# Altium schematic sheet k26_baseboard_fan.SchDoc: k26 Baseboard Fan
size A4; DrawnBy: Ch. Vogt; Organization: PBL; DocumentNumber: 1; Revision: r5; SheetNumber: 9
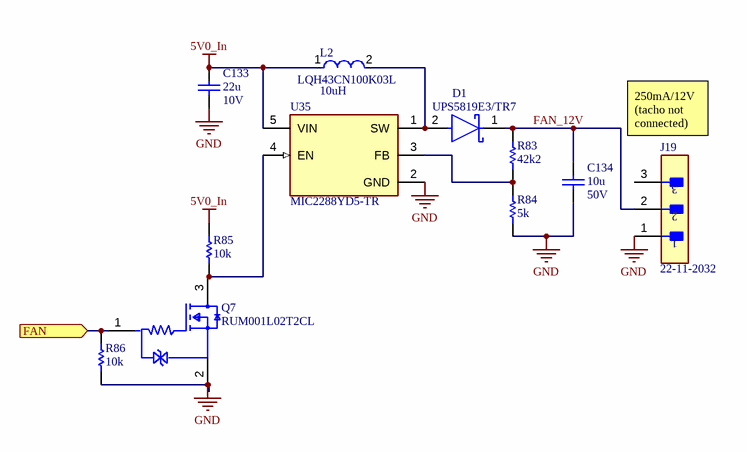
[diagram p0: k26_baseboard_fan.SchDoc]

## Parts
C133  22u  Rated DC Voltage (URdc): 10V  [CAPC1206]
C134  10u  Rated DC Voltage (URdc): 50V  [CAPC1206]
D1  UPS5819E3/TR7  [FP-457-04-MFG]
J19  22-11-2032  [FP-22-11-2032-MFG]
L2  LQH43CN100K03L  Inductance: 10uH  [FP-LQH43CN_03-MFG]
Q7  RUM001L02T2CL  [FP-VMT3-MFG]
R83  42k2  [RES0402]
R84  5k  [RES0402]
R85  10k  [RES0402]
R86  10k  [RES0402]
U35  MIC2288YD5-TR  [FP-TSOT-5LD-PL-1-MFG]

## Ports
FAN (in)

## Nets
5V0_In: C133.2 L2.1 R85.2 U35.5(VIN)
GND: C133.1 C134.1 J19.1 Q7.2(Source) R84.1 R86.1 U35.2(GND)
FAN: Q7.1(Gate) R86.2 ; port FAN
FAN_12V: C134.2 D1.1(C) J19.2 R83.2
NetD1_2: D1.2(A) L2.2 U35.1(SW)
NetQ7_3: Q7.3(Drain) R85.1 U35.4(EN)
NetR83_1: R83.1 R84.2 U35.3(FB)

Not connected (* = marked no-connect by the designer): J19 3

## Notes on the sheet
- 250mA/12V
  (tacho not connected)
- 1
- 2
- 3
- 4
- A
- B
- C
- Project:
- D
- Date:
- Drawing number:
- Rev:
- Format:
- A4 Q
- Drawn by:
- Laboratory:
- Page
- Sheet:
- of
- File:

## Library data of the parts
C133 = cap1206: Ceramic Capacitor, Multilayer, Ceramic, 10V, 10% +Tol, 10% -Tol, X7R, 15% TC, 22uF, Surface Mount, 1206; Manufacturer: Kyocera AVX; Manufacturer Part Number: 1206ZC226KAT2A; Multilayer: Yes; Supplier: Farnell; Supplier Part Number: 2094045; RoHS: Yes; Category: Ceramic Capacitors; Stock: 26392; Pricing: 5=0.49100, 50=0.42200, 250=0.37800, 500=0.33400, 1000=0.26300, 2500=0.23300, 12500=0.22800, 25000=0.22400 (CHF); Mounting Technology: Surface Mount; Pins: 2; Dielectric Material: Ceramic; Case/Package: 1206; Package Shape: Rectangular; Terminal Finish: Nickel; Min Operating Temperature: -55°C; Max Operating Temperature: 125°C; Value: 22uF; Capacitor Type: Ceramic; Tolerance  (fill in as +-): 10%; Packaging: Tape and Reel; Tolerance (fill in as +-): 10%; Termination: Wraparound; Temperature Characteristics Code: X7R; Package Style: SMTMeter; JESD-609 Code: e3; Length: 3.2mm; Width: 1.6mm; Height: 1.8mm; Reach SVHC Compliant: Yes; RoHS Compliant: Yes; ComponentLink1URL: https://datasheet.ciiva.com:443/pdfs/VipMasterIC/IC/AVXC/AVXC-S-A0009640452/AVXC-S-A0009640452-1.pdf?src-supplier=IHS+Markit; ComponentLink1Description: https://datasheet.ciiva.com:443/pdfs/VipMasterIC/IC/AVXC/AVXC-S-A0009640452/AVXC-S-A0009640452-1.pdf?src-supplier=IHS+Markit; ComponentLink2URL: https://datasheet.ciiva.com/25613/0900766b810a29b7-25613146.pdf?src-supplier=Rs; ComponentLink2Description: https://datasheet.ciiva.com/25613/0900766b810a29b7-25613146.pdf?src-supplier=Rs; ComponentLink3URL: https://datasheet.ciiva.com/7833/cx7r-7833598.pdf?src-supplier=Element14; ComponentLink3Description: https://datasheet.ciiva.com/7833/cx7r-7833598.pdf?src-supplier=Element14; ComponentLink4URL: https://datasheet.ciiva.com/5430/cx7r-218113-5430349.pdf?src-supplier=Mouser; ComponentLink4Description: https://datasheet.ciiva.com/5430/cx7r-218113-5430349.pdf?src-supplier=Mouser
C134 = cap1206: Ceramic Capacitor, Multilayer, Ceramic, 50V, 10% +Tol, 10% -Tol, X5R, 15% TC, 10uF, Surface Mount, 1206; Manufacturer: Murata; Manufacturer Part Number: GRM31CR61H106KA12L; Multilayer: Yes; Supplier: Distrelec; Supplier Part Number: 16576840; RoHS: Yes; Category: Ceramic Capacitors; Stock: 15417; Pricing: 3=0.63200, 100=0.56000, 250=0.50000, 500=0.44000, 2500=0.38000 (CHF); Mounting Technology: Surface Mount; Pins: 2; Dielectric Material: Ceramic; Case/Package: 1206; Package Shape: Rectangular; Terminal Finish: Nickel; Min Operating Temperature: -55°C; Max Operating Temperature: 85°C; Value: 10uF; Capacitor Type: Ceramic; Tolerance  (fill in as +-): 10%; Packaging: Tape and Reel; Tolerance (fill in as +-): 10%; Temperature Characteristics Code: X5R; JESD-609 Code: e3; Termination: Wraparound; Package Style: SMTMeter; Length: 3.2mm; Width: 1.6mm; Height: 1.6mm; Reach SVHC Compliant: Yes; RoHS Compliant: Yes; ComponentLink1URL: https://datasheet.ciiva.com:443/pdfs/VipMasterIC/IC/MURE/MURE-S-A0004373697/MURE-S-A0004376961-1.pdf?src-supplier=IHS+Markit; ComponentLink1Description: https://datasheet.ciiva.com:443/pdfs/VipMasterIC/IC/MURE/MURE-S-A0004373697/MURE-S-A0004376961-1.pdf?src-supplier=IHS+Markit; ComponentLink2URL: https://datasheet.ciiva.com/7719/1747481-7719155.pdf?src-supplier=Element14; ComponentLink2Description: https://datasheet.ciiva.com/7719/1747481-7719155.pdf?src-supplier=Element14; ComponentLink3URL: https://datasheet.ciiva.com/5427/product-5427068.pdf?src-supplier=Mouser; ComponentLink3Description: https://datasheet.ciiva.com/5427/product-5427068.pdf?src-supplier=Mouser; ComponentLink4URL: https://datasheet.ciiva.com/6270/partnumbering-e-01-6270263.pdf?src-supplier=Digi-Key; ComponentLink4Description: https://datasheet.ciiva.com/6270/partnumbering-e-01-6270263.pdf?src-supplier=Digi-Key; ComponentLink5URL: https://datasheet.ciiva.com/6270/partnumbering-e-01-6270262.pdf?src-supplier=Digi-Key; ComponentLink5Description: https://datasheet.ciiva.com/6270/partnumbering-e-01-6270262.pdf?src-supplier=Digi-Key; ComponentLink6URL: https://datasheet.ciiva.com/6270/partnumbering-e-01-6270264.pdf?src-supplier=Digi-Key; ComponentLink6Description: https://datasheet.ciiva.com/6270/partnumbering-e-01-6270264.pdf?src-supplier=Digi-Key; ComponentLink7URL: https://datasheet.ciiva.com/16440/c02e-16440669.pdf?src-supplier=Future+Electronics; ComponentLink7Description: https://datasheet.ciiva.com/16440/c02e-16440669.pdf?src-supplier=Future+Electronics
D1 = CMP-1055-00293-2: DIODE SCHOTTKY 40V 1A POWERMITE; Manufacturer: ON Semiconductor; Manufacturer Part Number: MBRM140T3G; Peak Non-Repetitive Surge Current: 50A; Forward Voltage: 550mV; Element Configuration: Single; Peak Reverse Current: 500uA; Polarity: Standard; Output Current: 1A; Number of Pins: 2; Lead Free: Lead Free; Package Quantity: 1; Width: 2.18mm; Current Rating: 1A; Min Operating Temperature: -55°C; Halogen Free: Halogen Free; Voltage Rating (DC): 40V; Max Repetitive Reverse Voltage (Vrrm): 40V; Forward Current: 1A; Radiation Hardening: No; Length: 2.05mm; Max Surge Current: 50A; Max Reverse Leakage Current: 500uA; Case/Package: 457; Packaging: Tape and Reel; Max Operating Temperature: 125°C; REACH SVHC: No SVHC; Height: 1.15mm; Max Forward Surge Current (Ifsm): 50A; Contact Plating: Tin; Average Rectified Current: 1A; Max Reverse Voltage (DC): 40V
J19 = CMP-04776-000113-1: CONN HEADER VERT 3POS 2.54MM; Manufacturer: Molex; Number Of Contacts: 3; Voltage Rating: 500V; Conn Gender: Male; Current Rating: 4A; Conn Orientation: Vertical; Device Class L2: Headers and Wire Housings; Number Of Rows: 1; Temperature Range High: +80°C; RoHS: TRUE; ComponentLink2URL: https://www.molex.com/webdocs/datasheets/pdf/en-us/0022112032_PCB_HEADERS.pdf; Manufacturer Part Number: 22-11-2032; Device Class L3: unset; Automotive: No; Temperature: -40°C to +80°C; Temperature Range Low: -40°C; Lead Free: Yes; Pitch: 2.54mm; Footprint Url: https://www.molex.com/pdm_docs/sd/022112032_sd.pdf; Digikey Description: CONN HEADER VERT 3POS 2.54MM; Contact Material: Gold,Nickel; Octopart: https://octopart.com/22-11-2032-molex-10085; Height: 10.91mm; Mouser Description: KK® 254 Solid Header, Vertical, with Friction Lock, 3 Circuits, Gold (Au) Plating; Package: 22-11-2032; Device Class L1: Connectors; Mounting Type: Through Hole; ComponentLink2Description: Datasheet; Category: Conn
L2 = CMP-06042-000232-1: FIXED IND 10UH 650MA 240 MOHM; Manufacturer: Murata; Tolerance: 10%; Shielding: Unshielded; Frequency: 23MHz; DC Resistance (DCR): 240mR; Test Frequency: 1MHz; Core Material: Ferrite; Number of Pins: 2; Case Code (Imperial): 1812; Radiation Hardening: No; Termination: SMD/SMT; Max Operating Temperature: 85°C; Self Resonant Frequency: 23MHz; Max DC Current: 650mA; Width: 3.2mm; Resistor Type: Wirewound; Inductance Tolerance: 10%; Height - Seated (Max): 0.11inch; Current Rating: 650mA; Length: 4.5mm; Height: 2.6mm; Military Standard: Not; DC Current: 650mA; Case/Package: 1812; Mount: Surface Mount; Packaging: Tape and Reel; Weight: 0.004586oz; Min Operating Temperature: -25°C; Package Quantity: 500; Depth: 3.4mm; Lead Free: Lead Free; REACH SVHC: No SVHC; Case Code (Metric): 4532; Manufacturer Part Number: LQH43CN100K03L
Q7 = CMP-08982-000008-1: MOSFET N-CH 20V 0.1A VMT3; Manufacturer: Rohm; Threshold Vgs Min: 0.3V; Power Dissipation: 150mW; Standoff Height: 0mm; Max Forward Diode Voltage: 1.2V; Number Of N Channels: 1; Input Capacitace At Vds: 7.1pF @ 10V; Gate To Source Voltage: 8V; Pulse Drain Current: 400mA; Depletion Mode: False; Rthja Max: 833°C/W; Turn On Delay Time: 5ns; Turn Off Delay Time: 20ns; Max Junction Temp: +150°C; Threshold Vgs Max: 1V; Continuous Drain Current: 100mA; Drain To Source Resistance: 2.5Ω; Mouser Description: MOSFET; Temperature Range High: +150°C; Height: 0.55mm; Device Class L3: MOSFETs; Manufacturer Part Number: RUM001L02T2CL; Octopart: https://octopart.com/rum001l02t2cl-rohm-24403092; ComponentLink2Description: Datasheet; Drain To Source Voltage: 20V; Footprint Url: https://d1d2qsbl8m0m72.cloudfront.net/en/techdata_basic/transistor/dimension/VMT3_Dimension.pdf; Number Of Channels: 1; Device Class L1: Discrete Semiconductors; Category: Trans; Device Class L2: Transistors; Lead Free: Yes; Automotive: No; Package: VMT3; Temperature Range Low: -55°C; ComponentLink2URL: https://d1d2qsbl8m0m72.cloudfront.net/en/products/databook/datasheet/discrete/transistor/mosfet/rum001l02t2cl-e.pdf; Digikey Description: MOSFET N-CH 20V 0.1A VMT3; Drain To Source Breakdown Voltage: 20V; RoHS: TRUE; Temperature: -55°C to +150°C
R83 = res0402: Fixed Resistor, Metal Glaze/thick Film, 0.063W, 42200ohm, 50V, 1% +/-Tol, 100ppm/Cel, Surface Mount, 0402; Manufacturer: Vishay; Manufacturer Part Number: CRCW040242K2FKED; Power: 63mW; Value: 42.2kR; Temperature Coefficient: 100ppm/°C; Rated Temperature: 70°C; Package Height: 0.35mm; Package Length: 1mm; Package Width: 0.5mm; Reference Standard: AEC-Q200; Supplier: Rs; Supplier Part Number: 6789314; RoHS: Yes; Category: Chip SMD Resistors; Stock: 17450; Pricing: 50=0.04800, 500=0.01900, 1000=0.01600, 2000=0.01300, 4000=0.01200 (CHF); Mounting Technology: Surface Mount; Pins: 2; Case/Package: 0402; Terminal Finish: Nickel; Package Shape: Rectangular; Min Operating Temperature: -55°C; Max Operating Temperature: 155°C; Tolerance: 1%; Resistor Type: FIXED RESISTOR; Packaging: Tape and Reel; Technology: METAL GLAZE/THICK FILM; Working Voltage: 50V; Construction: Chip; Package Style: SMTMeter; Termination: Wraparound; JESD-609 Code: e3; RoHS Compliant: Yes; Reach SVHC Compliant: Yes; ComponentLink1URL: https://datasheet.ciiva.com:443/pdfs/VipMasterIC/IC/VISH/VISH-S-A0007266705/VISH-S-A0007266705-1.pdf?src-supplier=IHS+Markit; ComponentLink1Description: https://datasheet.ciiva.com:443/pdfs/VipMasterIC/IC/VISH/VISH-S-A0007266705/VISH-S-A0007266705-1.pdf?src-supplier=IHS+Markit; ComponentLink2URL: https://datasheet.ciiva.com/3882/41397335s9853079n6892-3882805.pdf?src-supplier=Arrow+Electronics; ComponentLink2Description: https://datasheet.ciiva.com/3882/41397335s9853079n6892-3882805.pdf?src-supplier=Arrow+Electronics; ComponentLink3URL: https://datasheet.ciiva.com/11818/0900766b80d98824-11818095.pdf?src-supplier=Rs; ComponentLink3Description: https://datasheet.ciiva.com/11818/0900766b80d98824-11818095.pdf?src-supplier=Rs; ComponentLink4URL: https://datasheet.ciiva.com/2494/dcrcwe3-2494976.pdf?src-supplier=Digi-Key; ComponentLink4Description: https://datasheet.ciiva.com/2494/dcrcwe3-2494976.pdf?src-supplier=Digi-Key; ComponentLink5URL: https://datasheet.ciiva.com/2494/dcrcwe3-2494977.pdf?src-supplier=Digi-Key; ComponentLink5Description: https://datasheet.ciiva.com/2494/dcrcwe3-2494977.pdf?src-supplier=Digi-Key; ComponentLink6URL: https://datasheet.ciiva.com/3256/dcrcwe3-3256517.pdf?src-supplier=Avnet; ComponentLink6Description: https://datasheet.ciiva.com/3256/dcrcwe3-3256517.pdf?src-supplier=Avnet; ComponentLink7URL: https://datasheet.ciiva.com/16763/70201119-16763237.pdf?src-supplier=Allied+Electronics; ComponentLink7Description: https://datasheet.ciiva.com/16763/70201119-16763237.pdf?src-supplier=Allied+Electronics; ComponentLink8URL: https://datasheet.ciiva.com/8336/dcrcwe3-8336730.pdf?src-supplier=Avnet; ComponentLink8Description: https://datasheet.ciiva.com/8336/dcrcwe3-8336730.pdf?src-supplier=Avnet; ComponentLink9URL: https://datasheet.ciiva.com/2494/dcrcwe3-2494975.pdf?src-supplier=Digi-Key; ComponentLink9Description: https://datasheet.ciiva.com/2494/dcrcwe3-2494975.pdf?src-supplier=Digi-Key; ComponentLink10URL: https://datasheet.ciiva.com/7671/1697337-7671599.pdf?src-supplier=Element14; ComponentLink10Description: https://datasheet.ciiva.com/7671/1697337-7671599.pdf?src-supplier=Element14; ComponentLink11URL: https://datasheet.ciiva.com/22702/1697337-22702879.pdf?src-supplier=Element14; ComponentLink11Description: https://datasheet.ciiva.com/22702/1697337-22702879.pdf?src-supplier=Element14; ComponentLink12URL: https://datasheet.ciiva.com/7743/125364-7743643.pdf?src-supplier=Element14; ComponentLink12Description: https://datasheet.ciiva.com/7743/125364-7743643.pdf?src-supplier=Element14
R84 = res0402: Fixed Resistor, Thin Film, 0.05W, 5000ohm, 75V, 0.1% +/-Tol, 25ppm/Cel, Surface Mount, 0402; Manufacturer: Vishay Dale; Manufacturer Part Number: PNM0402E5001BST1; Power: 50mW; Rated Temperature: 70°C; Value: 5kR; Temperature Coefficient: 25ppm/°C; Supplier: Farnell; Supplier Part Number: 3596744; RoHS: Yes; Category: Chip SMD Resistors; Pricing: 1=1.39000, 50=1.30000, 100=1.14000, 250=0.97300, 500=0.96000, 1000=0.94800, 5000=0.93600, 10000=0.92300 (CHF); Mounting Technology: Surface Mount; Pins: 2; Package Shape: Rectangular; Case/Package: 0402; Min Operating Temperature: -55°C; Max Operating Temperature: 155°C; Tolerance: 0.1%; Resistor Type: FIXED RESISTOR; Packaging: Tape and Reel; Technology: THIN FILM; Termination: Wraparound; Working Voltage: 75V; RoHS Compliant: Yes; ComponentLink1URL: https://datasheet.ciiva.com:443/pdfs/VipMasterIC/IC/VISH/VISH-S-A0006240426/VISH-S-A0006240426-1.pdf?src-supplier=IHS+Markit; ComponentLink1Description: https://datasheet.ciiva.com:443/pdfs/VipMasterIC/IC/VISH/VISH-S-A0006240426/VISH-S-A0006240426-1.pdf?src-supplier=IHS+Markit; ComponentLink2URL: https://datasheet.ciiva.com/29717/pnm-29717417.pdf?src-supplier=Digi-Key; ComponentLink2Description: https://datasheet.ciiva.com/29717/pnm-29717417.pdf?src-supplier=Digi-Key; ComponentLink3URL: https://datasheet.ciiva.com/29717/pnm-29717416.pdf?src-supplier=Digi-Key; ComponentLink3Description: https://datasheet.ciiva.com/29717/pnm-29717416.pdf?src-supplier=Digi-Key; ComponentLink4URL: https://datasheet.ciiva.com/29717/pnm-29717418.pdf?src-supplier=Digi-Key; ComponentLink4Description: https://datasheet.ciiva.com/29717/pnm-29717418.pdf?src-supplier=Digi-Key
R85 R86 = res0402: Fixed Resistor, Metal Glaze/thick Film, 0.1W, 10000ohm, 50V, 1% +/-Tol, 100ppm/Cel, Surface Mount, 0402; Manufacturer: Panasonic; Manufacturer Part Number: ERJ-2RKF1002X; Power: 100mW; Value: 10kR; Temperature Coefficient: 100ppm/°C; Rated Temperature: 70°C; Package Height: 0.35mm; Package Length: 1mm; Package Width: 0.5mm; Reference Standard: AEC-Q200; Supplier: Rs; Supplier Part Number: 7325246; RoHS: Yes; Category: Chip SMD Resistors; Stock: 1630000; Pricing: 10000=0.00600, 30000=0.00500 (CHF); Mounting Technology: Surface Mount; Pins: 2; Case/Package: 0402; Terminal Finish: Nickel; Package Shape: Rectangular; Min Operating Temperature: -55°C; Max Operating Temperature: 155°C; Tolerance: 1%; Resistor Type: FIXED RESISTOR; Technology: METAL GLAZE/THICK FILM; Termination: Wraparound; Working Voltage: 50V; Construction: Rectangular; Package Style: SMTMeter; Packaging: Tape and Reel; JESD-609 Code: e3; Reach SVHC Compliant: Yes; RoHS Compliant: Yes; ComponentLink1URL: https://datasheet.ciiva.com:443/pdfs/VipMasterIC/IC/PANA/PANA-S-A0009889626/PANA-S-A0009889626-1.pdf?src-supplier=IHS+Markit; ComponentLink1Description: https://datasheet.ciiva.com:443/pdfs/VipMasterIC/IC/PANA/PANA-S-A0009889626/PANA-S-A0009889626-1.pdf?src-supplier=IHS+Markit
  R86: ComponentLink2URL: https://datasheet.ciiva.com/6201/426256-6201373.pdf?src-supplier=Farnell; ComponentLink2Description: https://datasheet.ciiva.com/6201/426256-6201373.pdf?src-supplier=Farnell; ComponentLink3URL: https://datasheet.ciiva.com/46377/426256-46377550.pdf?src-supplier=Element14; ComponentLink3Description: https://datasheet.ciiva.com/46377/426256-46377550.pdf?src-supplier=Element14; ComponentLink4URL: https://datasheet.ciiva.com/22749/1678782-22749610.pdf?src-supplier=Element14; ComponentLink4Description: https://datasheet.ciiva.com/22749/1678782-22749610.pdf?src-supplier=Element14; ComponentLink5URL: https://datasheet.ciiva.com/28695/1678782-28695781.pdf?src-supplier=Element14; ComponentLink5Description: https://datasheet.ciiva.com/28695/1678782-28695781.pdf?src-supplier=Element14; ComponentLink6URL: https://datasheet.ciiva.com/16766/70260748-16766015.pdf?src-supplier=Allied+Electronics; ComponentLink6Description: https://datasheet.ciiva.com/16766/70260748-16766015.pdf?src-supplier=Allied+Electronics; ComponentLink7URL: https://datasheet.ciiva.com/16765/70260748-16765054.pdf?src-supplier=Allied+Electronics; ComponentLink7Description: https://datasheet.ciiva.com/16765/70260748-16765054.pdf?src-supplier=Allied+Electronics; ComponentLink8URL: https://datasheet.ciiva.com/9181/aoa0000ce2-9181461.pdf?src-supplier=Avnet; ComponentLink8Description: https://datasheet.ciiva.com/9181/aoa0000ce2-9181461.pdf?src-supplier=Avnet; ComponentLink9URL: https://datasheet.ciiva.com/16508/aoa0000ce2-16508382.pdf?src-supplier=Future+Electronics; ComponentLink9Description: https://datasheet.ciiva.com/16508/aoa0000ce2-16508382.pdf?src-supplier=Future+Electronics
U35 = CMP-06325-000011-1: IC REG BOOST ADJ 1.2A TSOT23-5; Manufacturer: Microchip; Number of Outputs: 1; Output Current: 1A; Operating Supply Voltage: 10V; Switching Frequency: 1.2MHz; Output Configuration: Positive; Max Output Voltage: 34V; Min Input Voltage: 2.5V; Synchronous Rectifier: No; Output Type: Adjustable; Max Input Voltage: 10V; Width: 1.6mm; Max Output Current: 1A; Packaging: Tape and Reel; Max Operating Temperature: 125°C; Min Operating Temperature: -40°C; Package Quantity: 3000; Height: 0.87mm; Output Voltage: 34V; Min Output Voltage: 2.5V; Lead Free: Lead Free; Length: 2.9mm; REACH SVHC: No SVHC; Radiation Hardening: No; Min Supply Voltage: 2.5V; Case/Package: TSOT; Number of Pins: 5; Mount: Surface Mount; Topology: Boost; Manufacturer Part Number: MIC2288YD5-TR